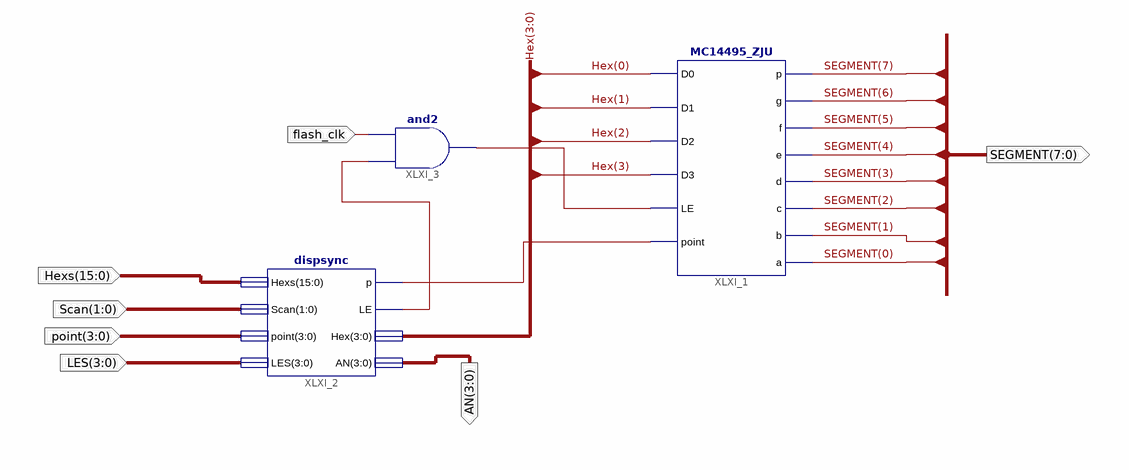
[diagram p0: schematic sheet 1]
// Xilinx ISE schematic Seg7_Dev16.sch (kintex7) as structural Verilog: 3 symbols, 7 ports
module Seg7_Dev16 (
  input  flash_clk,
  input  [15:0] Hexs,
  input  [1:0] Scan,
  input  [3:0] point,
  input  [3:0] LES,
  output [3:0] AN,
  output [7:0] SEGMENT
);

  wire XLXN_1, XLXN_3, XLXN_11;
  wire [3:0] Hex;

  MC14495_ZJU XLXI_1 (
    .D0(Hex[0]), .D1(Hex[1]), .D2(Hex[2]), .D3(Hex[3]), .LE(XLXN_3), .point(XLXN_11), .p(SEGMENT[7]),
    .g(SEGMENT[6]), .f(SEGMENT[5]), .e(SEGMENT[4]), .d(SEGMENT[3]), .c(SEGMENT[2]), .b(SEGMENT[1]),
    .a(SEGMENT[0]));
  dispsync XLXI_2 (.Hexs(Hexs), .Scan(Scan), .point(point), .LES(LES), .p(XLXN_11), .LE(XLXN_1), .Hex(Hex), .AN(AN));
  and XLXI_3 (XLXN_3, XLXN_1, flash_clk);
endmodule
